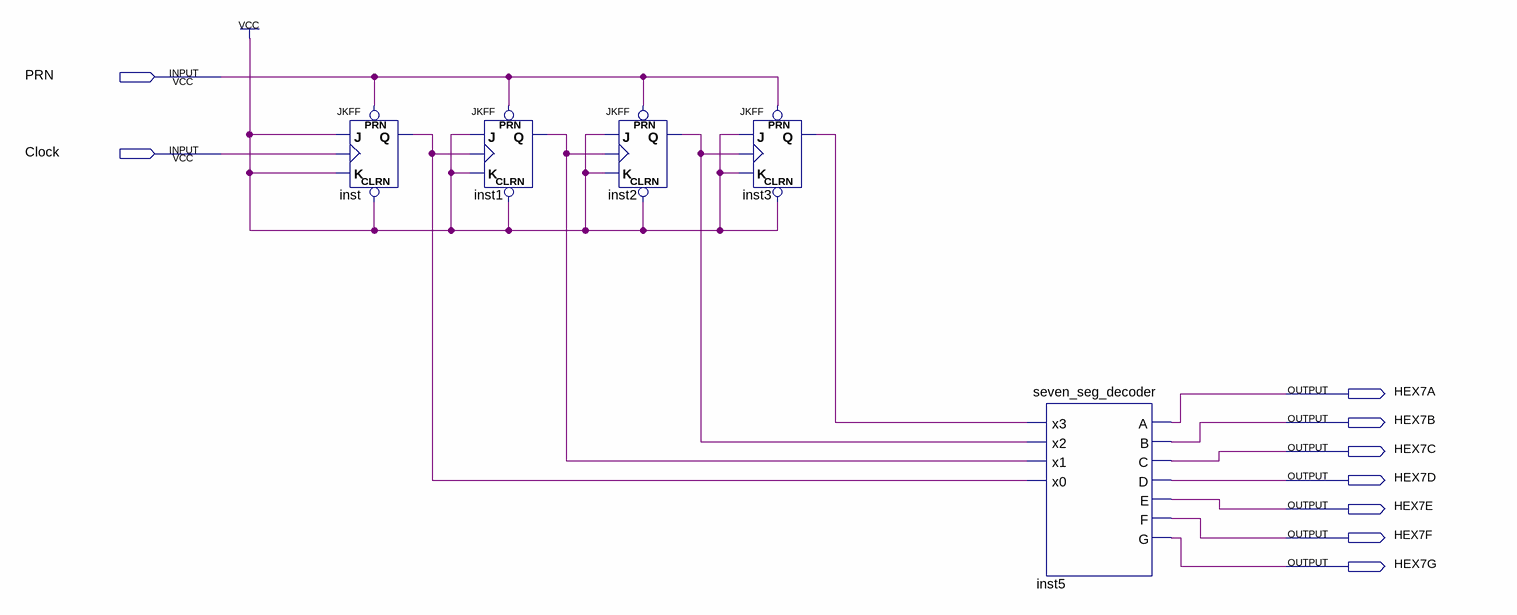
[diagram p0: schematic sheet]
// Quartus schematic lab10step3b.bdf as structural Verilog: 5 symbols, 9 pins
module lab10step3b (
  input  PRN,
  input  Clock,
  output HEX7A,
  output HEX7B,
  output HEX7C,
  output HEX7D,
  output HEX7E,
  output HEX7F,
  output HEX7G
);

  wire inst1_q, inst2_q, inst3_q, inst_q;

  JKFF inst (.PRN(PRN), .CLRN(1'b1), .K(1'b1), .J(1'b1), .CLK(Clock), .Q(inst_q));
  JKFF inst1 (.PRN(PRN), .CLRN(1'b1), .K(1'b1), .J(1'b1), .CLK(inst_q), .Q(inst1_q));
  JKFF inst2 (.PRN(PRN), .CLRN(1'b1), .K(1'b1), .J(1'b1), .CLK(inst1_q), .Q(inst2_q));
  JKFF inst3 (.PRN(PRN), .CLRN(1'b1), .K(1'b1), .J(1'b1), .CLK(inst2_q), .Q(inst3_q));
  seven_seg_decoder inst5 (
    .x3(inst3_q), .x2(inst2_q), .x1(inst1_q), .x0(inst_q), .A(HEX7A), .B(HEX7B), .C(HEX7C), .D(HEX7D),
    .E(HEX7E), .F(HEX7F), .G(HEX7G));
endmodule
